# EAGLE board RK3188-EVB_Rev_C1 (EAGLE 4.16), part 1 of 3
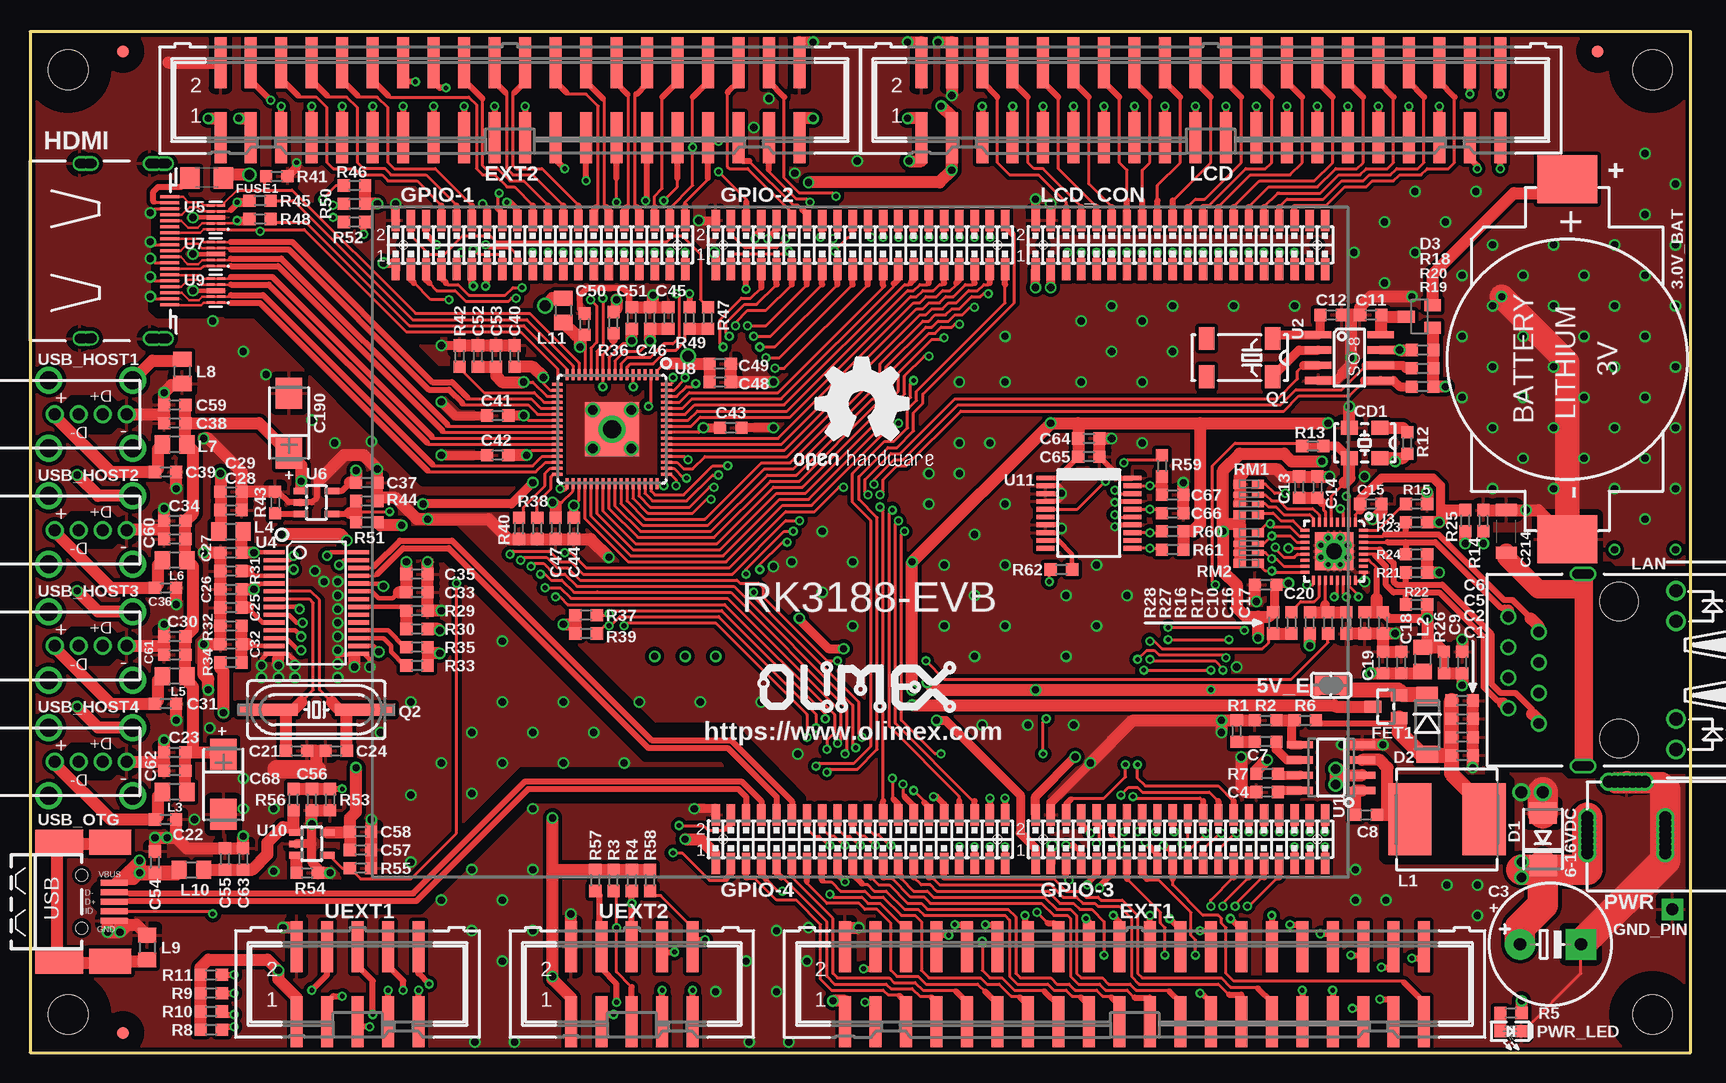
[diagram p5: board, top side]
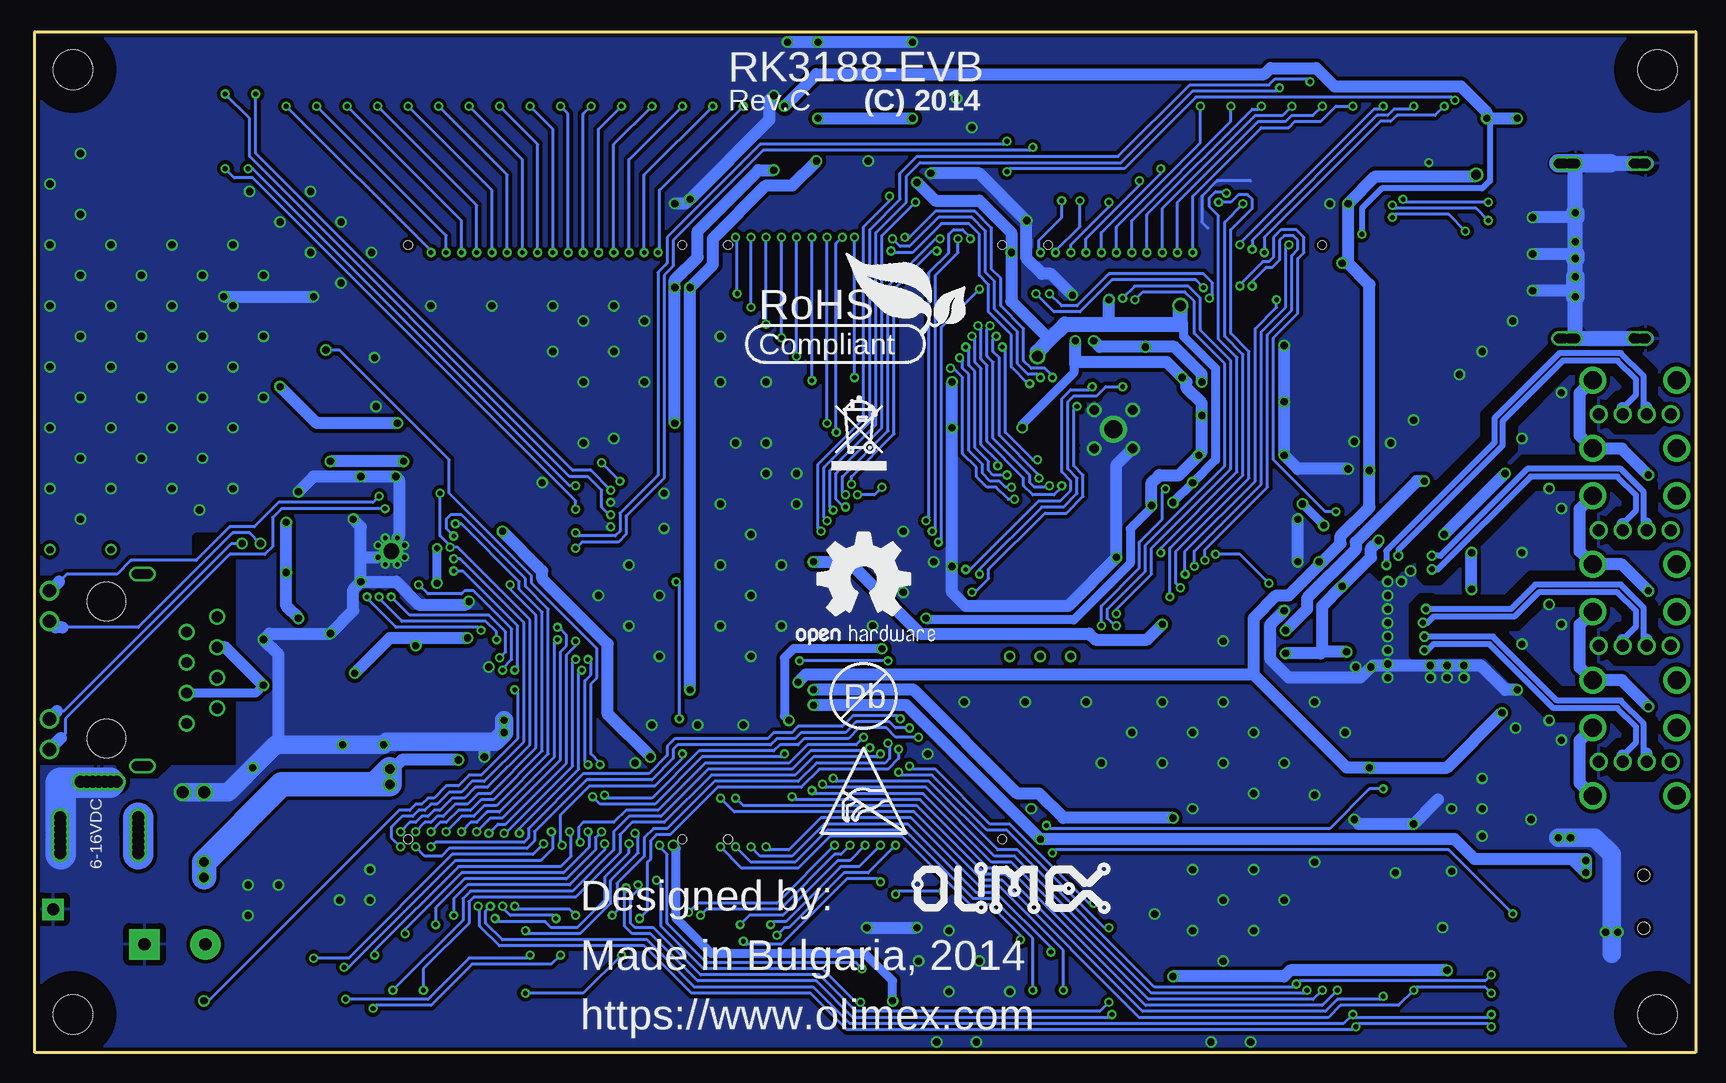
[diagram p6: board, bottom side, seen from below]

Size 138.43 x 85.09 mm. Coordinates in mm from the lower left corner, seen from the top.
Outline: 0,85.09 0,0 138.43,0 138.43,85.09 0,85.09
Copper layers (1+16): Top 0.035mm / dielectric 1.5mm / Bottom 0.035mm
Design rules "default": minimum track width 5mil, minimum drill 10mil, track to track 8mil, track to pad 8mil, pad to pad 8mil, via to via 8mil, smd to smd 1mil, copper to edge 10mil, drill to drill 8mil, minimum pad ring 7mil, minimum via ring 7mil, stop-mask expansion 4mil, vias tented up to drill 40mil, thermal gap 20mil
Net classes: 2 lan_sh: drill 0.762 mm
Holes 3.3 mm at 135.25,3.17 3.17,81.92 3.17,3.17 135.25,81.92
tRestrict: area 0,0 to 6.3,6.3; area 0,78.7 to 6.3,85.1; area 132.1,78.7 to 138.4,85.1; area 132.1,0 to 138.4,6.3; 75 lines
bRestrict: area 0,78.7 to 6.3,85.1; area 132.1,78.7 to 138.4,85.1; area 132.1,0 to 138.4,6.3; area 0,0 to 6.3,6.3; 99 lines

## Footprints (pad centres in the part's own frame; a part is rotated, then mirrored left to right if it is on the bottom)
3V_BAT_HOLDER = smd 2 x 2: 1+ -15,0 | smd 4 x 5: + -15,0; - 15,0
SJ-CLOSE = smd 1.168 x 1.6: 1 -0.762,0; 2 0.762,0
C0603_DWS = smd 1.016 x 1.016: 1 -0.889,0; 2 0.889,0
E5-10,5 = drill 1.016 pad 2.54 round: + -2.54,0 | drill 1.016 pad 2.54 square: - 2.54,0
CT6032 = smd 2.6 x 2.2: + 2.5,0; - -2.5,0
C1206_5MILS_WS_ISO = smd 1.016 x 1.778: 1 -1.778,0; 2 1.778,0
5032-4P_HCX-3S = smd 1.4 x 1.2: 1 -1.27,-1.27; 2 1.27,-1.27; 3 1.27,1.27; 4 -1.27,1.27
DO214AA = smd 1.778 x 2.286: A 2.177,0; C -2.177,0
MLL-41 = smd 1.45 x 1.8: A 2.445,0; K -2.445,0
SOT23C = smd 1.4 x 1: 1 1.1,-0.95; 2 1.1,0.95; 3 -1.1,0
ML40-MALE(GBH-254-SMT-40) = smd 1 x 4.25: 1 -24.13,-3.125; 2 -24.13,3.125; 3 -21.59,-3.125; 4 -21.59,3.125; 5 -19.05,-3.125; 6 -19.05,3.125; 7 -16.51,-3.125; 8 -16.51,3.125; 9 -13.97,-3.125; 10 -13.97,3.125; 11 -11.43,-3.125; 12 -11.43,3.125; 13 -8.89,-3.125; 14 -8.89,3.125; 15 -6.35,-3.125; 16 -6.35,3.125; 17 -3.81,-3.125; 18 -3.81,3.125; 19 -1.27,-3.125; 20 -1.27,3.125; 21 1.27,-3.125; 22 1.27,3.125; 23 3.81,-3.125; 24 3.81,3.125; 25 6.35,-3.125; 26 6.35,3.125; 27 8.89,-3.125; 28 8.89,3.125; 29 11.43,-3.125; 30 11.43,3.125; 31 13.97,-3.125; 32 13.97,3.125; 33 16.51,-3.125; 34 16.51,3.125; 35 19.05,-3.125; 36 19.05,3.125; 37 21.59,-3.125; 38 21.59,3.125; 39 24.13,-3.125; 40 24.13,3.125
SOT23 = smd 1.4 x 1: 1 1.1,-0.95; 2 1.1,0.95; 3 -1.1,0
FIDUCIAL-1X3 = smd 1 x 1: 1 0,0
1206 = smd 1.6 x 1.8: 1 -1.4,0; 2 1.4,0
TEST_PAD40/70/SQUARE = drill 1.016 pad 1.778 square: P$1 0,0
HDMI-SWM-19 = smd 0.25 x 1.6: 1 -4.5,-5.55; 2 -4,-5.55; 3 -3.5,-5.55; 4 -3,-5.55; 5 -2.5,-5.55; 6 -2,-5.55; 7 -1.5,-5.55; 8 -1,-5.55; 9 -0.5,-5.55; 10 0,-5.55; 11 0.5,-5.55; 12 1,-5.55; 13 1.5,-5.55; 14 2,-5.55; 15 2.5,-5.55; 16 3,-5.55; 17 3.5,-5.55; 18 4,-5.55; 19 4.5,-5.55 | drill 0.8 round: P$5 -7.3,-4.85; P$7 -7.3,1.25; P$9 7.3,1.25; P$11 7.3,-4.85; P$13 -7.3,-4.45; P$15 -7.3,1.65; P$18 7.3,1.65; P$20 7.3,-4.45; P$21 -7.3,-4.15; P$22 -7.3,-5; P$23 7.3,-5; P$24 7.3,-4.15; P$25 -7.3,-5.3; P$26 7.3,-5.3; P$27 7.3,0.95; P$28 -7.275,0.95; SH1 -7.3,-3.9; SH2 -7.3,1.95; SH3 7.3,1.95; SH4 7.3,-3.9
8X8MM_3131 = smd 3.6 x 6: 1 -3.1,0; 2 3.1,0
L0805_5MIL_DWS = smd 1.27 x 1.524: 1 -1.016,0; 2 1.016,0
RJLBC-060TC1_MILLING = drill 0.9 round: 1 -4.455,6.7; 2 -3.185,9.24; 3 -1.915,6.7; 4 -0.645,9.24; 5 0.625,6.7; 6 1.895,9.24; 7 3.165,6.7; 8 4.435,9.24 | drill 0.8 round: _1 -8,2.5; _2 -8,2.7; _3 -8,2.9; _4 -8,3.3; _5 -8,3.5; _6 8,3.5; _7 8,3.3; _8 8,2.9; _9 8,2.7; _10 8,2.5; GND1 -8,3.1; GND2 8,3.1 | drill 1.1 round: AG 4.07,-4.748; AY -6.61,-4.748; KG 6.61,-4.748; KY -4.07,-4.748 | hole 3.2: -5.715,0; 5.715,0
PWR_JACK_UNI_MILLING = drill 1 round: + 0,4.75; +1 0,5.25; +2 0,5.75; +3 0,6.25; +4 0,4.25; +5 0,3.75; +6 0,3.25; - -6.5,4.75; -1 -6.5,5.25; -2 -6.5,5.75; -3 -6.5,4.25; -4 -6.5,3.75; -5 -6.5,6.25; -6 -6.5,3.25; -- -3.3,0.3; --1 -3.8,0.3; --2 -4.3,0.3; --3 -4.8,0.3; --4 -2.8,0.3; --5 -2.3,0.3; --6 -1.8,0.3
LED-0603 = smd 1.016 x 1.016: A 0.889,0; C -0.889,0
MC-306 = smd 1.3 x 1.9: 1 -2.75,-1.6; 2 2.75,-1.6; 3 2.75,1.6; 4 -2.75,1.6
HC49/SMD2_THIN = smd 5 x 1: 1 -4.064,0; 2 4.064,0
R0603_5MIL_DWS = smd 1.016 x 1.016: 1 -0.889,0; 2 0.889,0
0603_0R = smd 1.016 x 1.016: 1 -0.889,0; 2 0.889,0
RK3188-SOM-EVB_REV_B = smd 0.7 x 1.8: 1-1 -38.735,22.733; 1-2 -38.735,26.797; 1-3 -37.465,22.733; 1-4 -37.465,26.797; 1-5 -36.195,22.733; 1-6 -36.195,26.797; 1-7 -34.925,22.733; 1-8 -34.925,26.797; 1-9 -33.655,22.733; 1-10 -33.655,26.797; 1-11 -32.385,22.733; 1-12 -32.385,26.797; 1-13 -31.115,22.733; 1-14 -31.115,26.797; 1-15 -29.845,22.733; 1-16 -29.845,26.797; 1-17 -28.575,22.733; 1-18 -28.575,26.797; 1-19 -27.305,22.733; 1-20 -27.305,26.797; 1-21 -26.035,22.733; 1-22 -26.035,26.797; 1-23 -24.765,22.733; 1-24 -24.765,26.797; 1-25 -23.495,22.733; 1-26 -23.495,26.797; 1-27 -22.225,22.733; 1-28 -22.225,26.797; 1-29 -20.955,22.733; 1-30 -20.955,26.797; 1-31 -19.685,22.733; 1-32 -19.685,26.797; 1-33 -18.415,22.733; 1-34 -18.415,26.797; 1-35 -17.145,22.733; 1-36 -17.145,26.797; 1-37 -15.875,22.733; 1-38 -15.875,26.797; 1-39 -14.605,22.733; 1-40 -14.605,26.797; 2-1 -12.065,22.733; 2-2 -12.065,26.797; 2-3 -10.795,22.733; 2-4 -10.795,26.797; 2-5 -9.525,22.733; 2-6 -9.525,26.797; 2-7 -8.255,22.733; 2-8 -8.255,26.797; 2-9 -6.985,22.733; 2-10 -6.985,26.797; 2-11 -5.715,22.733; 2-12 -5.715,26.797; 2-13 -4.445,22.733; 2-14 -4.445,26.797; 2-15 -3.175,22.733; 2-16 -3.175,26.797; 2-17 -1.905,22.733; 2-18 -1.905,26.797; 2-19 -0.635,22.733; 2-20 -0.635,26.797; 2-21 0.635,22.733; 2-22 0.635,26.797; 2-23 1.905,22.733; 2-24 1.905,26.797; 2-25 3.175,22.733; 2-26 3.175,26.797; 2-27 4.445,22.733; 2-28 4.445,26.797; 2-29 5.715,22.733; 2-30 5.715,26.797; 2-31 6.985,22.733; 2-32 6.985,26.797; 2-33 8.255,22.733; 2-34 8.255,26.797; 2-35 9.525,22.733; 2-36 9.525,26.797; 2-37 10.795,22.733; 2-38 10.795,26.797; 2-39 12.065,22.733; 2-40 12.065,26.797; 3-1 14.605,-26.797; 3-2 14.605,-22.733; 3-3 15.875,-26.797; 3-4 15.875,-22.733; 3-5 17.145,-26.797; 3-6 17.145,-22.733; 3-7 18.415,-26.797; 3-8 18.415,-22.733; 3-9 19.685,-26.797; 3-10 19.685,-22.733; 3-11 20.955,-26.797; 3-12 20.955,-22.733; 3-13 22.225,-26.797; 3-14 22.225,-22.733; 3-15 23.495,-26.797; 3-16 23.495,-22.733; 3-17 24.765,-26.797; 3-18 24.765,-22.733; 3-19 26.035,-26.797; 3-20 26.035,-22.733; 3-21 27.305,-26.797; 3-22 27.305,-22.733; 3-23 28.575,-26.797; 3-24 28.575,-22.733; 3-25 29.845,-26.797; 3-26 29.845,-22.733; 3-27 31.115,-26.797; 3-28 31.115,-22.733; 3-29 32.385,-26.797; 3-30 32.385,-22.733; 3-31 33.655,-26.797; 3-32 33.655,-22.733; 3-33 34.925,-26.797; 3-34 34.925,-22.733; 3-35 36.195,-26.797; 3-36 36.195,-22.733; 3-37 37.465,-26.797; 3-38 37.465,-22.733; 3-39 38.735,-26.797; 3-40 38.735,-22.733; 4-1 -12.065,-26.797; 4-2 -12.065,-22.733; 4-3 -10.795,-26.797; 4-4 -10.795,-22.733; 4-5 -9.525,-26.797; 4-6 -9.525,-22.733; 4-7 -8.255,-26.797; 4-8 -8.255,-22.733; 4-9 -6.985,-26.797; 4-10 -6.985,-22.733; 4-11 -5.715,-26.797; 4-12 -5.715,-22.733; 4-13 -4.445,-26.797; 4-14 -4.445,-22.733; 4-15 -3.175,-26.797; 4-16 -3.175,-22.733; 4-17 -1.905,-26.797; 4-18 -1.905,-22.733; 4-19 -0.635,-26.797; 4-20 -0.635,-22.733; 4-21 0.635,-26.797; 4-22 0.635,-22.733; 4-23 1.905,-26.797; 4-24 1.905,-22.733; 4-25 3.175,-26.797; 4-26 3.175,-22.733; 4-27 4.445,-26.797; 4-28 4.445,-22.733; 4-29 5.715,-26.797; 4-30 5.715,-22.733; 4-31 6.985,-26.797; 4-32 6.985,-22.733; 4-33 8.255,-26.797; 4-34 8.255,-22.733; 4-35 9.525,-26.797; 4-36 9.525,-22.733; 4-37 10.795,-26.797; 4-38 10.795,-22.733; 4-39 12.065,-26.797; 4-40 12.065,-22.733; LCD-1 14.605,22.733; LCD-2 14.605,26.797; LCD-3 15.875,22.733; LCD-4 15.875,26.797; LCD-5 17.145,22.733; LCD-6 17.145,26.797; LCD-7 18.415,22.733; LCD-8 18.415,26.797; LCD-9 19.685,22.733; LCD-10 19.685,26.797; LCD-11 20.955,22.733; LCD-12 20.955,26.797; LCD-13 22.225,22.733; LCD-14 22.225,26.797; LCD-15 23.495,22.733; LCD-16 23.495,26.797; LCD-17 24.765,22.733; LCD-18 24.765,26.797; LCD-19 26.035,22.733; LCD-20 26.035,26.797; LCD-21 27.305,22.733; LCD-22 27.305,26.797; LCD-23 28.575,22.733; LCD-24 28.575,26.797; LCD-25 29.845,22.733; LCD-26 29.845,26.797; LCD-27 31.115,22.733; LCD-28 31.115,26.797; LCD-29 32.385,22.733; LCD-30 32.385,26.797; LCD-31 33.655,22.733; LCD-32 33.655,26.797; LCD-33 34.925,22.733; LCD-34 34.925,26.797; LCD-35 36.195,22.733; LCD-36 36.195,26.797; LCD-37 37.465,22.733; LCD-38 37.465,26.797; LCD-39 38.735,22.733; LCD-40 38.735,26.797 | hole 0.7: -38.1,24.765; -15.24,24.765; -11.43,-24.765; 11.43,-24.765; 15.24,-24.765; 38.1,-24.765; -11.43,24.765; 11.43,24.765; 15.24,24.765; 38.1,24.765
R_MATRIX_4 = smd 0.762 x 1.016: 1.1 -1.27,-0.762; 1.2 -1.27,0.762; 4.1 1.27,-0.762; 4.2 1.27,0.762 | smd 0.508 x 1.016: 2.1 -0.381,-0.762; 2.2 -0.381,0.762; 3.1 0.381,-0.762; 3.2 0.381,0.762
SOIC8 = smd 0.6 x 2.2: 1 -1.905,-2.6; 2 -0.635,-2.6; 3 0.635,-2.6; 4 1.905,-2.6; 5 1.905,2.6; 6 0.635,2.6; 7 -0.635,2.6; 8 -1.905,2.6
SO-8 = smd 0.6 x 2.2: 1 -1.905,-2.6; 2 -0.635,-2.6; 3 0.635,-2.6; 4 1.905,-2.6; 5 1.905,2.6; 6 0.635,2.6; 7 -0.635,2.6; 8 -1.905,2.6
QFN-32(DRILLS) = smd 0.25 x 0.75: 1 -1.75,-2.425; 2 -1.25,-2.425; 3 -0.75,-2.425; 4 -0.25,-2.425; 5 0.25,-2.425; 6 0.75,-2.425; 7 1.25,-2.425; 8 1.75,-2.425; 17 1.75,2.425; 18 1.25,2.425; 19 0.75,2.425; 20 0.25,2.425; 21 -0.25,2.425; 22 -0.75,2.425; 23 -1.25,2.425; 24 -1.75,2.425 | smd 0.75 x 0.25: 9 2.425,-1.75; 10 2.425,-1.25; 11 2.425,-0.75; 12 2.425,-0.25; 13 2.425,0.25; 14 2.425,0.75; 15 2.425,1.25; 16 2.425,1.75; 25 -2.425,1.75; 26 -2.425,1.25; 27 -2.425,0.75; 28 -2.425,0.25; 29 -2.425,-0.25; 30 -2.425,-0.75; 31 -2.425,-1.25; 32 -2.425,-1.75 | drill 1.3 round: EP1 0,0 | drill 0.4 round: EP2 -0.5,1.1; EP3 0.5,1.1; EP4 1.1,0.5; EP5 1.1,-0.5; EP6 0.5,-1.1; EP7 -0.5,-1.1; EP8 -1.1,-0.5; EP9 -1.1,0.5 | smd 3.2 x 3.2: EXP_PAD 0,0
SSOP28 = smd 0.35 x 1.75: 1 -4.225,-3.525; 2 -3.575,-3.525; 3 -2.925,-3.525; 4 -2.275,-3.525; 5 -1.625,-3.525; 6 -0.975,-3.525; 7 -0.325,-3.525; 8 0.325,-3.525; 9 0.975,-3.525; 10 1.625,-3.525; 11 2.275,-3.525; 12 2.925,-3.525; 13 3.575,-3.525; 14 4.225,-3.525; 15 4.225,3.525; 16 3.575,3.525; 17 2.925,3.525; 18 2.275,3.525; 19 1.625,3.525; 20 0.975,3.525; 21 0.325,3.525; 22 -0.325,3.525; 23 -0.975,3.525; 24 -1.625,3.525; 25 -2.275,3.525; 26 -2.925,3.525; 27 -3.575,3.525; 28 -4.225,3.525
SLP2510P8 = smd 0.2 x 0.675: 1 -1,-0.438; 2 -0.5,-0.438; 4 0.5,-0.438; 5 1,-0.438; 6 1,0.438; 7 0.5,0.438; 9 -0.5,0.438; 10 -1,0.438 | smd 0.4 x 0.775: 3 0,-0.388; 8 0,0.388
SOT23-5 = smd 1.2 x 0.55: 1 1.3,-0.95; 2 1.3,0; 3 1.3,0.95; 4 -1.3,0.95; 5 -1.3,-0.95
QFN64(IT66121FN) = smd 0.9 x 0.25: 1 -4.55,3.75; 2 -4.55,3.25; 3 -4.55,2.75; 4 -4.55,2.25; 5 -4.55,1.75; 6 -4.55,1.25; 7 -4.55,0.75; 8 -4.55,0.25; 9 -4.55,-0.25; 10 -4.55,-0.75; 11 -4.55,-1.25; 12 -4.55,-1.75; 13 -4.55,-2.25; 14 -4.55,-2.75; 15 -4.55,-3.25; 16 -4.55,-3.75; 33 4.55,-3.75; 34 4.55,-3.25; 35 4.55,-2.75; 36 4.55,-2.25; 37 4.55,-1.75; 38 4.55,-1.25; 39 4.55,-0.75; 40 4.55,-0.25; 41 4.55,0.25; 42 4.55,0.75; 43 4.55,1.25; 44 4.55,1.75; 45 4.55,2.25; 46 4.55,2.75; 47 4.55,3.25; 48 4.55,3.75 | smd 0.25 x 0.9: 17 -3.75,-4.55; 18 -3.25,-4.55; 19 -2.75,-4.55; 20 -2.25,-4.55; 21 -1.75,-4.55; 22 -1.25,-4.55; 23 -0.75,-4.55; 24 -0.25,-4.55; 25 0.25,-4.55; 26 0.75,-4.55; 27 1.25,-4.55; 28 1.75,-4.55; 29 2.25,-4.55; 30 2.75,-4.55; 31 3.25,-4.55; 32 3.75,-4.55; 49 3.75,4.55; 50 3.25,4.55; 51 2.75,4.55; 52 2.25,4.55; 53 1.75,4.55; 54 1.25,4.55; 55 0.75,4.55; 56 0.25,4.55; 57 -0.25,4.55; 58 -0.75,4.55; 59 -1.25,4.55; 60 -1.75,4.55; 61 -2.25,4.55; 62 -2.75,4.55; 63 -3.25,4.55; 64 -3.75,4.55 | smd 4.5 x 4.5: GND 0,0 | drill 1.5 round: GND1 0,0 | drill 0.8 round: GND2 -1.6,1.6; GND3 1.6,1.6; GND4 1.6,-1.6; GND5 -1.6,-1.6
SSOP20 = smd 0.4 x 1.5: 1 -2.925,-3.625; 2 -2.275,-3.625; 3 -1.625,-3.625; 4 -0.975,-3.625; 5 -0.325,-3.625; 6 0.325,-3.625; 7 0.975,-3.625; 8 1.625,-3.625; 9 2.275,-3.625; 10 2.925,-3.625; 11 2.925,3.625; 12 2.275,3.625; 13 1.625,3.625; 14 0.975,3.625; 15 0.325,3.625; 16 -0.325,3.625; 17 -0.975,3.625; 18 -1.625,3.625; 19 -2.275,3.625; 20 -2.925,3.625
ML10_S = smd 1 x 4.25: 1 -5.08,-3.125; 2 -5.08,3.125; 3 -2.54,-3.125; 4 -2.54,3.125; 5 0,-3.125; 6 0,3.125; 7 2.54,-3.125; 8 2.54,3.125; 9 5.08,-3.125; 10 5.08,3.125
USB_A_VERTICAL_PTH = drill 1 round: 1 3.45,12.75; 2 3.45,14.75; 3 3.45,16.75; 4 3.45,18.75 | drill 1.5 round: P$1 0.6,12.25; P$2 6.3,12.25; P$3 6.3,19.25; P$4 0.6,19.25
USB_MINI_9PIN = smd 2.25 x 0.5: D+ 2.706,0; D- 2.706,0.8; GND 2.706,-1.6; ID 2.706,-0.8; VBUS 2.706,1.6 | smd 4 x 2.1: GND1 -1.9,4.95; GND3 -1.9,-4.95 | smd 3.5 x 2.1: GND2 2.35,4.95; GND4 2.35,-4.95 | hole 1: 0,2.2; 0,-2.2

## Placement (x,y rotation side)
3.0V_BAT  BTH-V-20-LF  [3V_BAT_HOLDER]  128.14,57.78 270 top
5V_E  Close  [SJ-CLOSE]  108.46,30.61 180 top
C1  22uF/6.3V  [C0603_DWS]  119.38,24.77 0 top
C2  22uF/6.3V  [C0603_DWS]  119.38,26.29 0 top
C3  470uF/25V/LOWESR/105C  [E5-10,5]  126.75,9.02 0 top
C4  100nF  [C0603_DWS]  103.12,21.72 180 top
C5  22uF/6.3V  [C0603_DWS]  119.38,27.81 0 top
C6  22uF/6.3V  [C0603_DWS]  119.38,29.34 0 top
C7  3.3nF  [C0603_DWS]  103,25.91 180 top
C8  10nF  [C0603_DWS]  111.38,19.81 0 top
C9  100nF  [C0603_DWS]  119.38,32.51 270 top
C10  10uF/6.3V  [C0603_DWS]  109.73,35.81 90 top
C11  100nF  [C0603_DWS]  111.76,61.47 0 top
C12  10pF  [C0603_DWS]  108.46,61.47 0 top
C13  100nF  [C0603_DWS]  105.79,47.12 270 top
C14  2.2uF/6.3V  [C0603_DWS]  107.31,47.12 270 top
C15  100nF  [C0603_DWS]  111.76,45.72 180 top
C16  100nF  [C0603_DWS]  111.25,35.81 90 top
C17  22uF/6.3V  [C0603_DWS]  112.78,35.81 90 top
C18  22uF/6.3V  [C0603_DWS]  114.3,32.51 270 top
C19  22uF/6.3V  [C0603_DWS]  112.78,32.51 270 top
C20  100nF  [C0603_DWS]  103,38.99 0 top
C21  33pF  [C0603_DWS]  22.23,25.15 180 top
C22  100nF  [C0603_DWS]  11.3,19.43 0 top
C23  22uF/6.3V  [C0603_DWS]  12.06,25.02 0 top
C24  33pF  [C0603_DWS]  25.53,25.15 0 top
C25  100nF  [C0603_DWS]  16.76,37.08 180 top
C26  100nF  [C0603_DWS]  16.76,38.61 180 top
C27  100nF  [C0603_DWS]  16.76,41.66 180 top
C28  10uF/6.3V  [C0603_DWS]  16.76,45.21 0 top
C29  100nF  [C0603_DWS]  16.76,46.74 0 top
C30  22uF/6.3V  [C0603_DWS]  12.06,34.67 0 top
C31  100nF  [C0603_DWS]  11.3,29.08 0 top
C32  2.2uF/6.3V  [C0603_DWS]  16.76,34.04 0 top
C33  100nF  [C0603_DWS]  32.26,38.35 0 top
C34  22uF/6.3V  [C0603_DWS]  12.06,44.32 0 top
C35  10uF/6.3V  [C0603_DWS]  32.26,39.88 0 top
C36  100nF  [C0603_DWS]  11.3,38.73 0 top
C37  22uF/6.3V  [C0603_DWS]  28.07,47.5 0 top
C38  22uF/6.3V  [C0603_DWS]  12.06,52.45 0 top
C39  100nF  [C0603_DWS]  11.3,48.39 0 top
C40  100nF  [C0603_DWS]  40.39,58.04 90 top
C41  100nF  [C0603_DWS]  38.99,53.09 180 top
C42  100nF  [C0603_DWS]  38.99,49.78 180 top
C43  100nF  [C0603_DWS]  58.42,52.07 0 top
C44  100nF  [C0603_DWS]  45.34,43.69 270 top
C45  100nF  [C0603_DWS]  53.21,61.21 90 top
C46  22uF/6.3V  [C0603_DWS]  51.69,61.21 90 top
C47  100nF  [C0603_DWS]  43.81,43.69 270 top
C48  100nF  [C0603_DWS]  57.53,55.88 0 top
C49  22uF/6.3V  [C0603_DWS]  57.53,57.4 0 top
C50  100nF  [C0603_DWS]  46.23,60.71 90 top
C51  100nF  [C0603_DWS]  50.16,61.21 90 top
C52  100nF  [C0603_DWS]  37.34,58.04 90 top
C53  22uF/6.3V  [C0603_DWS]  38.86,58.04 90 top
C54  100nF  [C0603_DWS]  10.41,15.88 90 top
C55  22uF/6.3V  [C0603_DWS]  16.26,16.13 90 top
C56  100nF  [C0603_DWS]  23.5,21.08 270 top
C57  100nF  [C0603_DWS]  27.56,16.89 0 top
C58  22uF/6.3V  [C0603_DWS]  27.56,18.41 0 top
C59  22uF/6.3V  [C0603_DWS]  12.06,53.98 0 top
C60  22uF/6.3V  [C0603_DWS]  12.06,42.8 0 top
C61  22uF/6.3V  [C0603_DWS]  12.06,33.15 0 top
C62  22uF/6.3V  [C0603_DWS]  12.06,23.5 0 top
C63  22uF/6.3V  [C0603_DWS]  17.78,16.13 90 top
C64  10uF/6.3V  [C0603_DWS]  88.27,51.18 0 top
C65  100nF  [C0603_DWS]  88.27,49.66 0 top
C66  10nF  [C0603_DWS]  95.25,44.96 180 top
C67  10nF  [C0603_DWS]  95.25,46.48 180 top
C68  NA(220uF/6.3V/tant)  [CT6032]  16.13,22.35 90 top
C190  NA(220uF/6.3V/tant)  [CT6032]  21.59,52.45 270 top
C214  1nF/2kV/X7R/1206  [C1206_5MILS_WS_ISO]  123.06,43.43 90 top
CD1  NA(50Mhz_osc_5032_4p)  [5032-4P_HCX-3S]  111.25,50.8 180 top
D1  SMBJ16A  [DO214AA]  126.11,17.78 90 top
D2  1N5822/SS34/SMA  [MLL-41]  116.46,27.3 270 top
D3  BAT54C  [SOT23C]  115.82,61.34 0 top
EXT1  GBH-254-SMT-40  [ML40-MALE(GBH-254-SMT-40)]  92.08,5.71 0 top
EXT2  GBH-254-SMT-40  [ML40-MALE(GBH-254-SMT-40)]  40.01,79.38 0 top
FET1  IRLML6402  [SOT23]  113.03,28.83 0 top
FID1  FIDUCIAL  [FIDUCIAL-1X3]  7.75,83.44 0 top
FID3  FIDUCIAL  [FIDUCIAL-1X3]  7.75,1.65 180 top
FID4  FIDUCIAL  [FIDUCIAL-1X3]  130.68,83.44 180 top
FUSE1  FSMD035  [1206]  14.73,72.9 180 top
GND_PIN  TESTPAD3  [TEST_PAD40/70/SQUARE]  136.91,11.94 180 top
HDMI  HDMI-MC34931HDMI-SWM-19  [HDMI-SWM-19]  6.1,66.8 90 top
L1  10uH/3.15A/20%  [8X8MM_3131]  118.11,19.43 0 top
L2  FB0805/600R/200mA(201209-601)  [L0805_5MIL_DWS]  116.08,32.77 270 top
L3  FB0805/600R/2A  [L0805_5MIL_DWS]  12.06,21.72 180 top
L4  FB0805/600R/2A  [L0805_5MIL_DWS]  16.76,43.43 0 top
L5  FB0805/600R/2A  [L0805_5MIL_DWS]  12.06,31.37 180 top
L6  FB0805/600R/2A  [L0805_5MIL_DWS]  12.06,41.02 180 top
L7  FB0805/600R/2A  [L0805_5MIL_DWS]  12.06,50.67 180 top
L8  FB0805/600R/2A  [L0805_5MIL_DWS]  12.7,56.77 90 top
L9  FB0805/600R/200mA(201209-601)  [L0805_5MIL_DWS]  9.78,8.76 270 top
L10  FB0805/600R/2A  [L0805_5MIL_DWS]  13.46,15.24 0 top
L11  CL470nH/0805/1.76R/250mA  [L0805_5MIL_DWS]  44.45,61.85 270 top
LAN  RJLBC-060TC1  [RJLBC-060TC1_MILLING]  132.46,31.88 90 top
LCD  GBH-254-SMT-40  [ML40-MALE(GBH-254-SMT-40)]  98.42,79.38 0 top
PWR  YDJ-1136  [PWR_JACK_UNI_MILLING]  129.79,22.86 180 top
PWR_LED  LED/RED/0603  [LED-0603]  123.44,1.78 180 top
Q1  MC-306_32.768KHZ/6pF  [MC-306]  100.84,57.91 180 top
Q2  Q12.000MHz/HC-49SM/SMD/20ppm/20pF  [HC49/SMD2_THIN]  23.88,28.57 0 top
R1  2.2k  [R0603_5MIL_DWS]  100.58,26.8 90 top
R2  1.05k/1%  [R0603_5MIL_DWS]  103,27.69 180 top
R3  NA(2.2k)  [R0603_5MIL_DWS]  48.64,14.35 90 top
R4  NA(2.2k)  [R0603_5MIL_DWS]  50.16,14.35 90 top
R5  2.2k  [R0603_5MIL_DWS]  123.44,3.3 180 top
R6  4.99k/1%  [R0603_5MIL_DWS]  106.3,27.69 0 top
R7  10k  [R0603_5MIL_DWS]  103.12,23.24 0 top
R8  NA(2.2k)  [R0603_5MIL_DWS]  15.11,1.91 180 top
R9  100k  [R0603_5MIL_DWS]  15.11,4.95 180 top
R10  NA(2.2k)  [R0603_5MIL_DWS]  15.11,3.43 180 top
R11  100k  [R0603_5MIL_DWS]  15.11,6.48 180 top
R12  NA(47k)  [R0603_5MIL_DWS]  114.81,50.8 90 top
R13  0R(board_mounted)  [0603_0R]  106.93,50.55 0 top
R14  560R  [R0603_5MIL_DWS]  121.16,44.32 90 top
R15  12.1k/1%  [R0603_5MIL_DWS]  115.57,45.72 180 top
R16  10k  [R0603_5MIL_DWS]  106.68,35.81 90 top
R17  NA  [R0603_5MIL_DWS]  108.2,35.81 90 top
R18  10k  [R0603_5MIL_DWS]  116.08,58.55 0 top
R19  NA  [R0603_5MIL_DWS]  116.08,55.5 0 top
R20  NA  [R0603_5MIL_DWS]  116.08,57.02 0 top
R21  49.9R/1%  [R0603_5MIL_DWS]  115.57,40.01 0 top
R22  49.9R/1%  [R0603_5MIL_DWS]  115.57,37.34 0 top
R23  49.9R/1%  [R0603_5MIL_DWS]  115.57,44.2 0 top
R24  49.9R/1%  [R0603_5MIL_DWS]  115.57,41.53 0 top
R25  560R  [R0603_5MIL_DWS]  119.63,44.32 270 top
R26  0R(board_mounted)  [0603_0R]  117.86,32.51 90 top
R27  150R  [R0603_5MIL_DWS]  105.16,35.81 90 top
R28  10k  [R0603_5MIL_DWS]  103.63,35.81 90 top
R29  NA(10k)  [R0603_5MIL_DWS]  32.26,36.83 180 top
R30  NA(5.1k)  [R0603_5MIL_DWS]  32.26,35.31 0 top
R31  680R/1%  [R0603_5MIL_DWS]  16.76,40.13 0 top
R32  NA(47k)  [R0603_5MIL_DWS]  16.76,35.56 180 top
R33  10k  [R0603_5MIL_DWS]  32.26,32.26 180 top
R34  4.99k/1%  [R0603_5MIL_DWS]  16.76,32.51 180 top
R35  47k  [R0603_5MIL_DWS]  32.26,33.78 180 top
R36  10k  [R0603_5MIL_DWS]  48.64,60.83 90 top
R37  2.2k  [R0603_5MIL_DWS]  46.35,36.45 180 top
R38  10k  [R0603_5MIL_DWS]  42.29,43.69 270 top
R39  2.2k  [R0603_5MIL_DWS]  46.35,34.92 180 top
R40  10k  [R0603_5MIL_DWS]  40.77,43.69 270 top
R41  47k  [R0603_5MIL_DWS]  20.57,73.03 0 top
R42  10k  [R0603_5MIL_DWS]  35.81,58.04 90 top
R43  6.8k/1%  [R0603_5MIL_DWS]  20.45,45.85 270 top
R44  10k  [R0603_5MIL_DWS]  28.07,45.97 180 top
R45  22R  [R0603_5MIL_DWS]  19.18,70.99 0 top
R46  2.2k  [R0603_5MIL_DWS]  27.05,72.26 0 top
R47  22R  [R0603_5MIL_DWS]  56.52,61.21 270 top
R48  22R  [R0603_5MIL_DWS]  19.18,69.47 0 top
R49  22R  [R0603_5MIL_DWS]  54.99,61.21 270 top
R50  2.2k  [R0603_5MIL_DWS]  27.05,70.74 0 top
R51  NA  [R0603_5MIL_DWS]  28.07,44.2 180 top
R52  10k  [R0603_5MIL_DWS]  27.05,69.22 0 top
R53  100k  [R0603_5MIL_DWS]  25.02,21.08 90 top
R54  13k/1%  [R0603_5MIL_DWS]  23.11,14.99 180 top
R55  100k  [R0603_5MIL_DWS]  27.56,15.37 180 top
R56  47k  [R0603_5MIL_DWS]  21.97,21.08 270 top
R57  100k  [R0603_5MIL_DWS]  47.12,14.35 90 top
R58  100k  [R0603_5MIL_DWS]  51.69,14.35 90 top
R59  20k  [R0603_5MIL_DWS]  94.36,48.9 270 top
R60  2.2k  [R0603_5MIL_DWS]  95.25,43.43 0 top
R61  2.2k  [R0603_5MIL_DWS]  95.25,41.91 0 top
R62  560R  [R0603_5MIL_DWS]  85.98,40.26 180 top
RK3188-SOM-EVB_PLATFORM1  RK3188-SOM-EVB_REV_B-5XGPH127SMT-02X20(PA-V16X-2X20-LF)  [RK3188-SOM-EVB_REV_B]  69.22,42.55 0 top
RM1  RA1206_(4X0603)_4B8_4.7k  [R_MATRIX_4]  101.6,46.1 90 top
RM2  RA1206_(4X0603)_4B8_4.7k  [R_MATRIX_4]  101.6,42.04 270 top
U1  MP1482DS  [SOIC8]  108.46,23.75 90 top
U2  PCF8563T/5  [SO-8]  109.98,57.91 270 top
U3  LAN8710A-EZC  [QFN-32(DRILLS)]  108.71,41.78 180 top
U4  GL850G-HHGXX  [SSOP28]  23.88,37.47 270 top
U5  NA(RCLAMP0524P)  [SLP2510P8]  15.49,69.6 90 top
U6  SY6280  [SOT23-5]  23.88,45.85 180 top
U7  NA(RCLAMP0524P)  [SLP2510P8]  15.49,66.55 90 top
U8  IT66121FN  [QFN64(IT66121FN)]  48.51,51.94 270 top
U9  NA(RCLAMP0524P)  [SLP2510P8]  15.49,63.5 90 top
U10  SY6280  [SOT23-5]  23.5,17.4 180 top
U11  AR1021-I/SS  [SSOP20]  88.27,44.96 270 top
U$2  [LOGO-OPENHARDWARE_8X8]  69.34,39.37 0 bottom
U$3  [OLIMEX1_V]  47.62,11.43 0 bottom
U$4  [LOGO-OPENHARDWARE_8X8]  69.34,53.98 0 top
U$8  [OLIMEX1_V]  78.36,28.19 0 top
U$9  [PB]  69.34,29.72 0 bottom
U$10  [ESD_SYMBOL]  72.9,18.29 0 bottom
U$11  [RECYCLE_BIN1/8]  72.01,48.51 0 bottom
U$12  [ROHS]  78.11,58.17 0 bottom
UEXT1  GBH-254-SMT-10  [ML10_S]  27.3,5.71 0 top
UEXT2  GBH-254-SMT-10  [ML10_S]  50.16,5.71 0 top
USB_HOST1  USB_A_VERTICAL  [USB_A_VERTICAL_PTH]  -10.67,56.64 270 top
USB_HOST2  USB_A_VERTICAL  [USB_A_VERTICAL_PTH]  -10.67,46.99 270 top
USB_HOST3  USB_A_VERTICAL  [USB_A_VERTICAL_PTH]  -10.67,37.34 270 top
USB_HOST4  USB_A_VERTICAL  [USB_A_VERTICAL_PTH]  -10.67,27.69 270 top
USB_OTG  USB-OTG  [USB_MINI_9PIN]  4.32,12.57 0 top

## Tracks (layer width: path | path; a pad name or v marks a point on that pad's centre or on a via)
#OVCUR1
  Top 0.356: U4.21 31.06,37.14 R29.2
  Top 1.016: R29.2 R30.1
+5V  (via drill 0.4, 0.6, 0.8)
  Top 0.356: U4.23 28.49,38.44 29.08,37.85 30.23,37.85 30.73,38.35
  Top 0.508: U6.5 25.97,46.8 26.67,47.5
  Top 0.762: RK3188-SOM-EVB_PLATFORM1.1-1 30.48,65.79 v29.46,65.79 | v83.82,63.75 RK3188-SOM-EVB_PLATFORM1.LCD-1
  Top 1.016: v124.33,4.32 R5.1 | 26.67,47.5 C37.1 v27.18,48.51 | R34.2 15.88,32 16.13,31.75 v16.13,28.32 | 30.73,38.35 C33.1 C35.1 v31.37,40.89 | U10.5 26.67,18.35 C58.1 | C58.1 C57.1 | C58.1 26.67,19.56 27.18,20.07 v27.18,23.75 | R46.2 R50.2 v28.96,70.74 | FUSE1.1 16.39,73.15 v18.29,73.15 | 5V_E.2 107.31,30.23 v98.42,30.23 v83.82,30.23 75.44,30.23 v74.8,30.86 | EXT2.39 64.14,77.85 v65.28,77.85 | v73.15,77.85 74.3,77.85 LCD.1 74.3,74.3 v73.28,74.3
  Bottom 0.254: v124.33,4.32 123.95,4.32 108.08,20.19 107.19,20.19 106.68,20.7 106.17,20.7 105.66,21.21 105.16,21.21 104.14,22.23 103.12,22.23 102.23,23.11 101.22,23.11 98.17,26.16 98.17,29.97 v98.42,30.23
  Bottom 1.016: v16.13,28.32 20.7,23.75 v27.18,23.75 29.08,23.75 36.83,31.5 | v73.15,77.85 v65.28,77.85 | 28.96,65.79 v28.96,70.74 26.67,73.03 18.41,73.03 v18.29,73.15 | 36.83,31.5 36.83,36.2 34.92,38.1 33.91,38.1 31.37,40.64 v31.37,40.89 31.11,40.89 29.59,42.42 29.59,43.05 27.18,45.47 v27.18,48.51 27.18,64.01 28.96,65.79 | 28.96,65.79 v29.46,65.79 | v73.28,74.3 75.31,72.26 77.47,72.26 81.92,67.82 81.92,65.66 v83.82,63.75 v83.82,30.23 | 36.83,31.5 74.17,31.5 v74.8,30.86
+5V_OTG_PWR  (via drill 0.6)
  Top 0.508: 7.62,14.48 7.62,14.17 USB_OTG.VBUS 7.02,14.26 7.49,14.73
  Top 0.762: RK3188-SOM-EVB_PLATFORM1.4-1 57.15,16.51 57.02,16.64
  Top 1.016: FET1.3 108.84,28.83 108.71,28.96 v73.53,28.96 | 57.02,16.64 55.88,17.78 v54.61,17.78 | v9.14,16 v9.14,14.99 8.64,14.48 7.62,14.48 v9.14,16
  Top 1.27: v9.14,14.99 C54.1 12.19,14.99 L10.1
  Bottom 1.016: 10.29,16.13 18.41,16.13 20.07,17.78 v54.61,17.78 65.79,28.96 v73.53,28.96 | 10.29,16.13 v9.14,14.99 v9.14,16 9.14,16.13 10.29,16.13
+12V  (via drill 0.6, 0.8)
  Top 1.016: 108.84,23.11 109.6,23.11 | 109.6,23.11 U1.2 | 108.84,23.11 v108.84,23.62 109.09,23.62 109.6,23.11 | 108.84,23.11 v108.84,22.35 109.6,23.11 | R7.1 102.23,23.5 v103.12,24.38 | v124.33,15.88 124.33,15.24 v124.33,14.61
  Top 2.54: 126.11,15.24 129.79,15.24 PWR.+ 129.79,19.56 | 126.11,15.24 126.11,12.32 124.21,10.41 C3.+ | 124.33,15.24 126.11,15.24 | 126.11,15.24 D1.C
  Bottom 1.016: v103.12,24.38 107.82,24.38 108.84,23.37
  Bottom 1.524: v124.33,15.88 v124.33,14.61 | 108.84,23.37 v108.84,23.62
  Bottom 2.032: 108.84,23.37 v108.84,22.35 110.11,22.35 | 110.11,22.35 117.86,22.35 v124.33,15.88 v124.33,14.61 | v108.84,23.62 110.11,22.35
  Bottom 2.54: 129.79,19.56 PWR.+ 129.79,16.51
ADC_IN0  (via drill 0.4)
  Top 0.508: RK3188-SOM-EVB_PLATFORM1.3-5 86.36,14.61 v86.61,14.35 | EXT1.3 70.48,4.19 v69.6,4.19
  Bottom 0.254: v69.6,4.19 69.98,4.19 72.77,6.99 82.68,6.99 86.23,10.54 86.23,13.97 v86.61,14.35
ADC_IN2  (via drill 0.4)
  Top 0.254: 70.48,6.99 EXT1.4
  Top 0.508: v86.36,17.27 87,17.27 87.63,16.64 RK3188-SOM-EVB_PLATFORM1.3-7 | v69.47,6.99 70.48,6.99
  Bottom 0.254: v69.47,6.99 69.98,7.49 82.42,7.49 85.72,10.79 85.72,16.51 86.36,17.14 v86.36,17.27
AVDD2  (via drill 0.6)
  Top 0.356: U4.1 18.7,41.69 v18.67,41.66 | U4.5 19.15,39.09 v18.67,38.61 | U4.10 19.41,35.84 18.16,37.08
  Top 1.016: v18.67,41.66 C27.1 17.65,43.31 L4.2 | v18.67,38.61 C26.1 C25.1 18.16,37.08
  Bottom 1.016: v18.67,38.61 v18.67,41.66
CIF_CLKI
  Top 0.254: 44.45,70.61 41.91,73.15 40.26,73.15 39.75,73.66 39.75,79.88 39.62,80.01
  Top 0.508: 44.45,70.61 RK3188-SOM-EVB_PLATFORM1.1-24 | EXT2.20 38.73,80.9 39.62,80.01
CIF_CLKO
  Top 0.254: 45.72,70.61 42.67,73.66 40.51,73.66 40.26,73.91 40.26,79.88 40.39,80.01
  Top 0.508: 45.72,70.61 RK3188-SOM-EVB_PLATFORM1.1-26 | EXT2.22 41.27,80.9 40.39,80.01
CIF_D0  (via drill 0.4)
  Top 0.508: v31.11,78.87 EXT2.13 | RK3188-SOM-EVB_PLATFORM1.1-21 v43.18,66.67
  Bottom 0.254: v43.18,66.67 43.18,70.87 36.45,77.6 34.16,77.6 33.66,78.11 31.88,78.11 v31.11,78.87
CIF_D1  (via drill 0.4)
  Top 0.508: v33.66,78.87 EXT2.15 | RK3188-SOM-EVB_PLATFORM1.1-23 v44.45,66.67
  Bottom 0.254: v44.45,66.67 44.45,70.36 36.7,78.11 34.42,78.11 v33.66,78.87
CIF_D2  (via drill 0.4)
  Top 0.508: v36.2,78.87 EXT2.17 | RK3188-SOM-EVB_PLATFORM1.1-25 v45.72,66.67
  Bottom 0.254: v45.72,66.67 45.72,69.85 36.96,78.61 36.45,78.61 v36.2,78.87
CIF_D3  (via drill 0.4)
  Top 0.508: v38.73,78.87 EXT2.19 | RK3188-SOM-EVB_PLATFORM1.1-27 v46.99,66.67
  Bottom 0.254: v46.99,66.67 46.99,69.34 38.73,77.6 v38.73,78.87
CIF_D4  (via drill 0.4)
  Top 0.508: v41.27,78.87 EXT2.21 | RK3188-SOM-EVB_PLATFORM1.1-29 v48.26,66.67
  Bottom 0.254: v48.26,66.67 48.26,68.71 48.26,68.83 41.27,75.82 v41.27,78.87
CIF_D5  (via drill 0.4)
  Top 0.508: v44.58,73.66 43.81,74.42 EXT2.23 | RK3188-SOM-EVB_PLATFORM1.1-31 v49.53,66.67
  Bottom 0.254: v49.53,66.67 49.53,68.33 44.58,73.28 v44.58,73.66
CIF_D6  (via drill 0.4)
  Top 0.508: v46.35,72.64 EXT2.25 | RK3188-SOM-EVB_PLATFORM1.1-33 v50.8,66.67
  Bottom 0.254: v50.8,66.67 50.8,67.82 46.35,72.26 v46.35,72.64
CIF_D7  (via drill 0.4)
  Top 0.254: v48.9,70.87 48.9,72.9
  Top 0.508: 48.9,72.9 EXT2.27 | RK3188-SOM-EVB_PLATFORM1.1-35 v52.07,66.67
  Bottom 0.254: v52.07,66.67 52.07,67.31 48.9,70.48 v48.9,70.87
CIF_D8  (via drill 0.4)
  Top 0.254: v51.31,70.99 51.44,71.12
  Top 0.508: 51.44,71.12 EXT2.29 | RK3188-SOM-EVB_PLATFORM1.1-37 v53.34,66.67
  Bottom 0.254: v53.34,66.67 53.34,66.8 51.31,68.83 v51.31,70.99
CIF_D9  (via drill 0.4)
  Top 0.254: v52.83,70.99 53.98,72.14 53.98,72.9
  Top 0.508: RK3188-SOM-EVB_PLATFORM1.1-39 v54.61,66.67 | 53.98,72.9 EXT2.31
  Bottom 0.254: v54.61,66.67 54.74,66.8 54.74,67.69 52.83,69.6 v52.83,70.99
CIF_D10/SDA  (via drill 0.4)
  Top 0.254: 54.61,70.61 54.61,70.87 56.52,72.77 56.52,72.9 | U11.13 v93.34,43.33 94.26,43.33 R60.1
  Top 0.508: RK3188-SOM-EVB_PLATFORM1.1-40 54.61,70.61 | 56.52,72.9 56.52,75.95 | 56.52,75.95 EXT2.33 | 56.52,75.95 v57.4,75.95
  Bottom 0.254: v57.4,75.95 57.66,75.69 77.98,75.69 85.72,67.94 85.72,65.79 86.49,65.02 86.49,48.13 89.66,44.96 89.66,43.43 90.04,43.05 93.06,43.05 v93.34,43.33
CIF_D11/SCL  (via drill 0.4)
  Top 0.254: 53.34,70.23 53.34,70.36 55.24,72.26 v55.24,75.44 55.24,79.63 | U11.11 v93.34,42.03 94.24,42.03 R61.1
  Top 0.508: RK3188-SOM-EVB_PLATFORM1.1-38 53.34,70.23 | EXT2.34 56.52,80.9 55.24,79.63
  Bottom 0.254: v55.24,75.44 55.5,75.18 77.72,75.18 85.22,67.69 85.22,65.53 85.98,64.77 85.98,47.88 89.15,44.7 89.15,43.18 89.79,42.55 92.83,42.55 v93.34,42.03
CIF_D12
  Top 0.254: 52.07,70.48 52.07,71.37 52.7,72.01 52.7,79.63
  Top 0.508: RK3188-SOM-EVB_PLATFORM1.1-36 52.07,70.48 | EXT2.32 53.98,80.9 52.7,79.63
CIF_D13
  Top 0.254: 50.55,70.48 50.42,70.61 50.42,79.76 50.55,79.88
  Top 0.508: RK3188-SOM-EVB_PLATFORM1.1-34 50.8,70.23 50.55,70.48 | EXT2.30 51.44,80.77 50.55,79.88
CIF_D14
  Top 0.254: 49.78,70.48 49.91,70.61 49.91,79.76 49.78,79.88
  Top 0.508: RK3188-SOM-EVB_PLATFORM1.1-32 49.53,70.23 49.78,70.48 | EXT2.28 48.9,80.77 49.78,79.88
CIF_D15
  Top 0.254: 48.01,70.48 47.88,70.61 47.88,79.38 47.75,79.5
  Top 0.508: RK3188-SOM-EVB_PLATFORM1.1-30 48.26,70.23 48.01,70.48 | EXT2.26 46.35,80.9 47.75,79.5
CIF_HREF
  Top 0.254: 43.18,70.61 41.15,72.64 40.01,72.64 38.99,73.66 37.97,73.66 37.72,73.91 37.72,79.5
  Top 0.508: 43.18,70.61 RK3188-SOM-EVB_PLATFORM1.1-22 | EXT2.18 36.2,81.03 37.72,79.5
CIF_VSYNC
  Top 0.254: 47.24,70.48 47.37,70.61 47.37,78.87 46.35,79.88 44.83,79.88 44.7,80.01
  Top 0.508: RK3188-SOM-EVB_PLATFORM1.1-28 46.99,70.23 47.24,70.48 | EXT2.24 43.81,80.9 44.7,80.01
DM1  (via drill 0.5)
  Top 0.356: U4.27 26.18,41.04 v25.78,40.64
  Bottom 0.508: 4.08,53.74 4.32,53.98 4.32,56.39 6.22,58.29 11.34,58.29 16.76,52.87 16.76,50.84 25.78,41.82 v25.78,40.64
  Bottom 1.016: USB_HOST1.2 4.08,53.74
DM2  (via drill 0.5)
  Top 0.356: U4.2 21.61,41.04 v21.97,41.4
  Bottom 0.508: 4.08,44.09 4.32,44.32 4.32,46.74 6.22,48.64 14.02,48.64 21.26,41.4 v21.97,41.4
  Bottom 1.016: USB_HOST2.2 4.08,44.09
DM3  (via drill 0.5)
  Top 0.356: U4.8 22.3,37.14 v22.48,36.96
  Bottom 0.508: 4.08,34.44 4.32,34.67 4.32,37.08 6.22,38.99 13.36,38.99 15.39,36.96 v22.48,36.96
  Bottom 1.016: USB_HOST3.2 4.08,34.44
DM4  (via drill 0.5)
  Top 0.356: U4.11 22.09,35.19 v22.61,34.67
  Bottom 0.508: 4.08,24.91 4.32,25.15 4.32,27.43 6.22,29.34 11.56,29.34 16.89,34.67 v22.61,34.67
  Bottom 1.016: USB_HOST4.2 4.08,24.91
DP1  (via drill 0.5)
  Top 0.356: U4.28 25.05,41.69 v24.77,41.4
  Bottom 0.508: v24.77,41.4 24.77,41.91 16.1,50.57 16.1,52.6 11.05,57.66 6.5,57.66 4.95,56.11 4.95,54.84 6.08,53.71
  Bottom 1.016: USB_HOST1.3 6.08,53.71
DP2  (via drill 0.5)
  Top 0.356: U4.3 21.84,40.39 v21.97,40.26
  Bottom 0.508: 6.08,44.05 6.08,44.08 4.95,45.21 4.95,46.46 6.5,48.01 13.74,48.01 21.49,40.26 v21.97,40.26
  Bottom 1.016: 6.08,44.05 USB_HOST2.3
DP3  (via drill 0.5)
  Top 0.356: v22.73,35.81 22.23,35.81 21.55,36.49 U4.9
  Bottom 0.508: 6.08,34.4 4.95,35.53 4.95,36.8 6.5,38.35 13.08,38.35 15.11,36.32 21.84,36.32 22.35,35.81 v22.73,35.81
  Bottom 1.016: 6.08,34.4 USB_HOST3.3
DP4  (via drill 0.5)
  Top 0.356: U4.12 21.34,34.54 22.35,33.53 v22.61,33.53
  Bottom 0.508: v22.61,33.53 22.35,33.53 21.84,34.04 17.17,34.04 11.84,28.7 6.5,28.7 4.95,27.15 4.95,25.88 6.08,24.75
  Bottom 1.016: USB_HOST4.3 6.08,24.75
DVDD1  (via drill 0.6)
  Top 0.356: U4.24 29.24,39.09 v29.46,38.86 | U4.16 28.59,33.89 v29.08,33.4
  Top 1.016: L4.1 15.88,43.56 C28.1 15.88,46.61 | 15.88,46.61 C29.1 | v15.88,48.26 15.88,46.61 | 33.15,33.4 R33.1 | 33.15,33.4 R35.1 | v34.16,33.27 33.27,33.27 33.15,33.4 | v20.95,43.18 25.91,43.18 v26.42,42.67
  Bottom 1.016: v20.95,43.18 v15.88,48.26 | v29.08,33.4 31.11,33.4 | v26.42,42.67 27.05,42.04 27.05,41.27 v29.46,38.86 31.11,37.21 31.11,33.4 | v34.16,33.27 31.24,33.27 31.11,33.4
GND  (via drill 0.4, 0.6, 1)
  Top 0.254: U3.25 111.25,40.03 v111.25,39.24 110.46,39.24 U3.24 | HDMI.2 10.22,62.8 v10.03,62.99 | HDMI.5 10.37,64.3 v10.03,64.64 | HDMI.8 10.4,65.8 v10.03,66.17 | HDMI.11 10.29,67.3 v10.03,67.56 | HDMI.17 10.36,70.3 v10.03,69.98 | U4.15 27.85,33.24 | PWR_LED.C 124.46,1.78 129.29,6.6 C3.-
  Top 0.356: 20.7,33.24 U4.14 19.78,33.24 19.3,32.77 v19.3,32.26 | 20.7,32.89 20.7,33.24 | U4.15 27.05,33.24 27.05,33.15 | 27.05,32.89 27.05,33.15 | 27.85,33.24 28.32,32.77 v28.32,32.13 | 20.7,33.24 21.5,33.24 22.1,32.64 v22.1,32.26 | 27.05,33.15 25.65,33.15 | 25.65,33.15 v25.65,32.38 | 25.65,33.15 v25.65,33.53
  Top 0.381: v13.59,69.6 U5.8 U5.3 | v13.59,66.55 U7.8 U7.3 | v13.59,63.5 U9.8 U9.3
  Top 0.406: U11.20 90.93,47.88 C65.2 | U11.17 90.51,45.93 v90.42,45.85 | U11.14 90.59,43.98 v90.42,43.81 | U11.3 85.98,46.58 | U11.2 85.74,47.23 85.98,46.99 v85.98,46.61 85.98,46.58 | U11.4 85.68,45.93 85.98,46.23 85.98,46.58 | U11.7 85.81,43.98 85.98,43.81 v85.98,43.69 85.98,43.56 85.75,43.33 U11.8
  Top 0.508: 100.84,45.97 RM1.2.2 | R43.1 20.7,46.74 21.59,45.85 U6.2 23.5,45.85 23.88,46.23 23.88,47.5 24.13,47.75 | 7.49,10.54 7.49,10.97 USB_OTG.GND 6.48,10.97 6.48,10.54 | C50.2 45.85,61.98 45.85,63.12 46.48,63.75 49.4,63.75 49.91,63.25 49.91,62.36 C51.2
  Top 0.762: U2.4 108.84,56.01 109.47,56.64 | 23.5,17.4 U10.2 | 23.5,17.4 v23.5,19.05 | 23.5,17.4 23.5,15.88 24,15.37 R54.1 | v61.98,52.07 C43.2 | R41.2 22.23,73.79 v22.23,74.17 | RK3188-SOM-EVB_PLATFORM1.3-4 85.09,20.83 v88.39,24.13 | RK3188-SOM-EVB_PLATFORM1.4-2 57.15,20.32 v55.37,20.32 | v85.09,70.74 RK3188-SOM-EVB_PLATFORM1.LCD-4 | v83.82,71.12 RK3188-SOM-EVB_PLATFORM1.LCD-2 | v55.75,69.34 RK3188-SOM-EVB_PLATFORM1.2-2 | RK3188-SOM-EVB_PLATFORM1.1-2 v30.48,70.74 | C41.2 35.43,53.09 v34.29,54.23 | v34.29,49.78 C42.2 | v34.29,58.93 R42.2
  Top 1.016: C6.2 C5.2 C2.2 C1.2 v120.27,23.75 | v99.31,27.69 R1.2 R2.2 | v99.31,27.69 v99.31,26.67 v99.31,27.69 | v100.97,24.64 100.97,22.1 101.35,21.72 C4.2 | C18.1 C19.1 C17.1 | v113.79,34.92 C17.1 | v116.46,46.74 R15.1 | C17.1 C16.1 C10.1 | v119.38,34.42 C9.1 | v108.33,48.01 C14.1 C13.1 104.52,48.01 103.89,48.64 101.47,48.64 100.84,48.01 RM1.4.2 RM1.3.2 100.84,45.97 | v111.89,44.45 112.01,44.45 112.65,45.09 C15.1 | v102.23,37.59 102.11,37.72 C20.1 | 110.11,61.47 C12.2 | 109.47,56.64 110.11,57.28 v110.11,57.91 110.11,61.47 | 110.11,61.47 C11.1 110.87,62.1 111.76,62.99 v115.19,62.99 | L8.1 12.57,55.63 11.81,55.63 v11.18,54.99 C59.1 11.18,53.21 | USB_HOST1.4 8.1,53.21 11.18,53.21 | USB_HOST2.4 8.1,43.56 11.18,43.56 | USB_HOST4.4 8.1,24.26 11.18,24.26 | USB_HOST3.4 8.1,33.91 11.18,33.91 | 12.19,17.91 C22.2 | C29.2 C28.2 | R43.1 C29.2 | v14.48,41.66 C27.2 R31.1 C26.2 C25.2 R32.2 C32.1 v14.48,34.04 14.48,31.5 14.86,31.11 v14.86,30.23 | v14.48,51.18 14.86,51.18 17.65,48.39 C29.2 | v20.7,32.26 20.7,32.89 | v27.05,32.13 27.05,32.89 | 28.96,46.23 C37.2 v28.96,48.64 27.81,49.78 26.16,49.78 24.13,47.75 | 28.96,46.23 R44.1 | 23.88,25.15 C21.1 | 23.88,25.15 C24.1 | 12.19,17.91 13.08,17.02 C55.2 C63.2 v17.78,18.03 | 23.88,23.62 23.88,25.15 | R53.1 C56.2 v23.5,19.05 | R55.1 C57.2 C58.2 v28.45,19.43 | C54.2 v10.41,17.91 v11.43,17.91 12.19,17.91 | v7.49,10.03 7.49,10.54 | 6.48,10.54 v6.48,10.03 v7.49,10.03 | v7.49,10.03 8.13,10.67 8.89,10.67 L9.1 | C40.2 C53.2 C52.2 R42.2 | 51.94,62.1 C45.2 | C51.2 C46.2 51.94,62.1 | v61.98,55.88 C48.2 C49.2 | v34.29,36.83 R29.1 C33.2 C35.2 v33.15,40.89 | 51.94,62.1 v51.94,63.12 | 109.47,25.65 U1.4 v112.78,25.65
  Top 1.016: UEXT1.2 22.23,10.41 v21.08,10.41 | UEXT2.2 v45.09,11.56 | EXT1.2 67.94,10.41 v69.09,10.41 | v88.39,24.13 91.95,27.69 v99.31,27.69 | EXT2.40 64.14,84.2 v65.28,84.2 | LCD.2 74.3,84.2 v73.15,84.2 | v75.69,84.2 76.83,84.2 LCD.4 v76.83,79.76 | 3.0V_BAT.- 125.72,45.21 v124.71,45.21 C214.2 R14.2 | R54.1 v25.02,14.99 | CD1.2 v109.98,53.85 | 28.96,46.23 30.48,46.23 32.26,44.45 v33.15,44.45 38.23,44.45 39.88,42.8 R40.2 R38.2 C47.2 C44.2 46.74,42.8 v48.26,41.27 | v12.19,27.69 C31.2 | 11.18,24.26 C62.1 | v11.18,26.04 C23.1 11.18,24.26 | v11.18,35.69 C30.1 11.18,33.91 | 11.18,33.91 C61.1 | v12.19,37.34 C36.2 | v11.18,45.34 C34.1 11.18,43.56 | C60.1 11.18,43.56 | 11.18,53.21 C38.1 | v12.19,46.99 C39.2 | C65.2 C64.2 v90.17,51.18 | C66.1 C67.1 v96.14,47.5 | 11.56,82.5 EXT2.2
  Top 1.524: 20.57,23.62 23.88,23.62
  Top 1.778: 133.09,22.48 PWR.-- | 136.29,21.84 136.29,22.2 136.02,22.48 133.09,22.48 | 133.09,22.48 132.21,22.48
  Top 2.032: 3.0V_BAT.- 128.14,57.53 v122.68,62.99
  Top 2.54: C3.- 136.29,16.02 PWR.- 136.29,21.84 | v126.11,21.72 D1.A
  Bottom 0.254: 40.64,68.71 41.15,69.22 41.15,71.37 39.88,72.64 37.08,72.64
  Bottom 1.016: 118.36,25.65 118.11,25.91 118.11,33.15 v119.38,34.42 118.87,34.92 v113.79,34.92 111.89,36.83 111.89,38.61 v111.25,39.24 | v111.25,39.24 108.33,39.24 106.43,37.34 102.49,37.34 v102.23,37.59 | v116.46,46.74 115.19,48.01 v111.25,48.01 v108.33,48.01 108.08,47.75 108.08,43.02 U3.EP6 | v122.68,62.99 v115.19,62.99 | 111.25,41.28 U3.EP9 | v111.25,39.24 111.25,41.28 | 111.25,41.28 111.25,43.81 v111.89,44.45 | v14.86,30.23 15.88,30.23 17.91,32.26 v20.7,32.26 v22.1,32.26 26.92,32.26 v27.05,32.13 27.94,31.24 33.91,31.24 35.43,32.77 35.43,35.69 v34.29,36.83 | v7.49,10.03 6.99,10.03 v6.48,10.03 | 21.46,21.08 v23.5,19.05 28.07,19.05 v28.45,19.43 | 10.03,69.6 v13.59,69.6 | 10.03,66.55 v13.59,66.55 | 10.03,63.5 v13.59,63.5 | U8.GND4 48.26,49 v48.26,41.27 52.32,37.21 60.83,37.21 61.98,38.35 v61.98,40.51 v61.98,52.07 v61.98,55.88 | 100.97,25.91 v100.97,24.64 | v69.09,10.41 v64.9,10.41 | v65.28,84.2 v73.15,84.2 v75.69,84.2 | v85.09,70.74 84.2,70.74 v83.82,71.12 77.22,77.72 77.22,79.38 v76.83,79.76 | v51.94,63.12 53.72,64.9 54.48,64.9 55.75,66.17 v55.75,69.34 59.69,73.28 v63.75,73.28 | v33.15,40.89 v33.15,44.45 | v34.29,58.93 v34.29,54.23 v34.29,49.78 33.15,48.64 v28.96,48.64
  Bottom 1.27: v10.03,64.64 v10.03,66.17 | 10.03,66.55 v10.03,67.56 10.03,69.6 | v10.03,69.98 10.03,74.11 | 4.06,74.1 HDMI.SH3 7.11,74.1 | 4.06,59.5 HDMI.SH2 10.03,59.5 | 10.03,59.5 v10.03,62.99 | 10.03,59.5 HDMI.SH1 11.43,59.5
  Bottom 1.524: v126.11,21.72 v124.33,21.72 122.3,21.72 v120.27,23.75 118.36,25.65 v112.78,25.65 v109.35,25.65 109.09,25.91 100.97,25.91 100.08,25.91 v99.31,26.67 v99.31,27.69 | v11.43,17.91 v10.41,17.91 8.38,17.91 6.99,16.51 6.99,10.03 6.99,8.26 | 11.43,74.1 HDMI.SH4 8.89,74.1 | v10.03,62.99 10.03,63.5 v10.03,64.64 | v10.03,66.17 10.03,66.55 | 10.03,69.6 v10.03,69.98 | 10.03,74.11 8.89,74.11 8.89,74.1 | 8.89,74.1 7.11,74.1
  Bottom 2.54: 136.27,16.51 136.27,22.48 132.21,22.48
  other vias: 19.3,31.24 20.7,31.24 22.1,31.24 25.65,31.24 25.65,34.67 60.33,77.09 61.59,79.5 39.37,29.21 44.45,29.21 41.91,26.67 46.99,26.67 39.37,24.13 44.45,24.13 49.53,24.13 50.8,29.21 55.88,29.21 60.96,29.21 81.28,35.56 81.28,40.64 81.28,45.72 78.74,43.18 78.74,33.02 76.2,35.56 74.93,45.72 77.47,48.26 81.28,55.88 74.93,48.26 77.47,50.8 86.36,33.02 86.36,38.1 88.9,35.56 91.44,38.1 78.74,38.1 76.2,40.64 87.63,55.88 92.71,55.88 90.17,58.42 95.25,58.42 92.71,60.96 87.63,60.96 90.17,62.23 95.25,62.23 100.33,62.23 105.41,62.23 77.47,55.88 81.28,59.69 80.01,50.8 36.83,26.67 36.83,21.59 34.29,24.13 41.91,15.24 41.91,10.16 36.83,10.16 39.37,12.7 36.83,15.24 39.37,7.62 34.29,12.7 87,27.3 83.19,27.3 79.38,27.3 68.58,35.56 68.58,40.89 63.5,40.89 66.04,43.43 115.44,66.67 134.62,44.45 137.16,46.99 132.08,46.99 134.62,49.53 137.16,52.07 132.08,52.07 134.62,54.61 137.16,57.15 132.08,57.15 134.62,59.69 137.16,62.23 132.08,62.23 134.62,64.77 137.16,67.31 132.08,67.31 134.62,69.85 129.54,64.77 129.54,59.69 129.54,54.61 129.54,49.53 127,46.99 127,52.07 127,57.15 127,62.23 127,67.31 121.92,67.31 110.36,66.67 112.9,69.22 117.98,69.22 120.52,71.75 134.62,74.93 137.16,72.39 124.46,64.77 121.92,62.23 124.46,59.69 119.38,59.69 121.92,57.15 119.38,54.61 124.46,54.61 121.92,52.07 124.46,49.53 121.92,46.99 119.38,64.77 112.9,64.14 115.44,71.75 64.01,24.89 25.65,35.81 25.65,36.96 25.65,38.1 25.65,39.24 24.51,39.24 23.75,40.13 66.04,38.35 57.15,5.08 59.69,7.62 62.23,5.08 64.77,7.62 62.23,10.16 41.91,20.32 37.08,0.89 40.39,0.89 59.94,0.89 63.25,0.89 39.37,34.29 31.75,21.46 31.75,15.88 31.75,29.21 29.21,26.67 14.99,27.05 13.72,19.43 20.32,20.32 17.78,22.86 20.32,15.11 17.78,20.32 15.24,60.96 17.78,58.42 19.68,56.52 23.5,52.7 25.4,50.8 28.45,50.93 100.58,32.13 110.49,15.24 110.49,12.7 113.03,12.7 118.11,13.97 120.65,13.97 120.65,11.43 68.96,74.3 88.9,40.64 92.71,50.8
  pour Top (isolate 0.305, rank 2): 140.97,-2.54 -2.54,-2.54 -2.54,87.63 140.97,87.63 140.97,40.64 132.21,40.64 131.83,41.02 125.86,41.02 125.48,41.4 125.48,43.05 125.09,43.43 121.92,43.43 121.16,42.67 121.16,23.24 127.64,23.24 128.14,22.73 130.68,22.73 131.06,23.11 140.84,23.11
  pour Bottom (isolate 0.305, rank 3): -5.08,-5.08 143.51,-5.08 143.51,23.88 131.83,23.88 130.68,22.73 128.14,22.73 127,23.88 121.54,23.88 121.54,43.05 121.92,43.43 125.09,43.43 125.48,43.05 125.48,41.4 125.86,41.02 131.06,41.02 132.21,39.88 143.51,39.88 143.51,90.17 -5.08,90.17
  pour Bottom (isolate 0.406, no thermals): 106.68,44.32 110.87,44.32 110.87,40.01 106.68,40.01
  pour Bottom (isolate 0.406, no thermals): 44.07,56.39 52.96,56.39 52.96,47.5 44.07,47.5
  pour Top (isolate 0.406, no thermals): 44.7,55.88 52.32,55.88 52.32,48.13 44.7,48.13
GPIO0_A1  (via drill 0.4)
  Top 0.508: EXT2.5 v20.95,78.87 | v35.94,66.67 35.56,66.29 RK3188-SOM-EVB_PLATFORM1.1-9
  Bottom 0.254: v35.94,66.67 35.94,67.94 26.29,77.6 25.4,77.6 24.89,78.11 21.72,78.11 v20.95,78.87
GPIO0_A2/ETH_SOFT_RST  (via drill 0.4)
  Top 0.254: v74.68,32.64 76.2,31.11 105.16,31.11 108.2,34.16 R17.1 | v40.89,41.02 41.15,41.27 43.05,41.27 43.94,40.39 44.83,40.39 45.85,39.37 58.93,39.37 59.18,39.12 60.71,39.12 61.09,38.73 61.09,37.97 66.42,32.64 v67.31,32.64
  Top 0.508: v36.96,63.88 36.83,64.01 RK3188-SOM-EVB_PLATFORM1.1-11
  Bottom 0.254: v67.31,32.64 v74.68,32.64 | v36.96,63.88 36.96,64.26 35.81,65.41 35.31,65.41 34.67,66.04 34.67,67.69 34.29,68.07 33.53,68.07 33.15,67.69 33.15,66.93 33.66,66.42 33.66,61.85 35.69,59.82 35.69,47.12 40.89,41.91 v40.89,41.02
GPIO0_A3/USB-HOST-DRV  (via drill 0.4)
  Top 0.254: 27.18,45.09 v29.97,45.09
  Top 0.508: U6.4 26.61,44.9 26.67,44.96 | v37.97,63.88 38.1,64.01 RK3188-SOM-EVB_PLATFORM1.1-13
  Top 1.016: 27.18,44.96 R51.2 | 27.18,44.96 27.18,45.09 R44.2 | 26.67,44.96 27.18,44.96
  Bottom 0.254: v37.97,63.88 37.97,64.01 36.07,65.91 35.56,65.91 35.18,66.29 35.18,67.94 34.54,68.58 33.27,68.58 32.64,67.94 32.64,66.67 33.15,66.17 33.15,61.59 35.18,59.56 35.18,49.4 30.86,45.09 v29.97,45.09
GPIO0_A5  (via drill 0.4)
  Top 0.254: v36.96,66.93 37.34,66.55 39.24,66.55 39.37,66.42
  Top 0.508: EXT2.7 v23.5,78.87 | 39.37,66.42 RK3188-SOM-EVB_PLATFORM1.1-15
  Bottom 0.254: v36.96,66.93 36.96,67.69 26.54,78.11 25.65,78.11 25.15,78.61 23.75,78.61 v23.5,78.87
GPIO0_A6  (via drill 0.4)
  Top 0.254: v37.97,67.31 38.23,67.06 40.01,67.06 40.64,66.42
  Top 0.508: EXT2.9 v26.04,78.87 | 40.64,66.42 RK3188-SOM-EVB_PLATFORM1.1-17
  Bottom 0.254: v37.97,67.31 37.97,67.44 26.8,78.61 26.29,78.61 v26.04,78.87
GPIO0_A7  (via drill 0.4)
  Top 0.508: v28.57,78.87 EXT2.11 | RK3188-SOM-EVB_PLATFORM1.1-19 v41.91,66.67
  Bottom 0.254: v41.91,66.67 41.91,71.37 36.2,77.09 33.91,77.09 33.4,77.6 31.24,77.6 29.97,78.87 v28.57,78.87
GPIO0_B0
  Top 0.254: 34.29,70.61 32.26,72.64 29.84,72.64 29.34,73.15 27.56,73.15 27.05,73.66 25.27,73.66 24.77,74.17 24.77,78.74 23.88,79.63 22.48,79.63 22.35,79.76
  Top 0.508: 34.29,70.61 RK3188-SOM-EVB_PLATFORM1.1-8 | EXT2.6 20.95,81.15 22.35,79.76
GPIO0_B1
  Top 0.254: 24.77,79.76 24.89,79.63 26.42,79.63 27.3,78.74 27.3,74.17 27.81,73.66 29.59,73.66 30.1,73.15 33.02,73.15 35.56,70.61
  Top 0.508: EXT2.8 23.5,81.03 24.77,79.76 | 35.56,70.61 RK3188-SOM-EVB_PLATFORM1.1-10
GPIO0_B2
  Top 0.254: 36.83,70.61 33.78,73.66 30.35,73.66 29.84,74.17 29.84,78.74 28.96,79.63 27.43,79.63 27.3,79.76
  Top 0.508: 36.83,70.61 RK3188-SOM-EVB_PLATFORM1.1-12 | EXT2.10 26.04,81.03 27.3,79.76
GPIO0_B4/LED1  (via drill 0.4)
  Top 0.254: v43.81,37.97 44.2,37.97 44.83,37.34 57.91,37.34 67.06,28.19 67.06,26.67 66.42,26.04 v66.42,25.27
  Top 0.508: EXT1.18 88.27,10.92 v88.01,11.18 | v37.72,70.74 38.1,70.36 RK3188-SOM-EVB_PLATFORM1.1-14
  Bottom 0.254: v88.01,11.18 87.38,11.81 87.38,15.88 87.12,16.13 87.12,17.65 86.61,18.16 85.47,18.16 81.53,22.1 74.55,22.1 73.03,23.62 67.31,23.62 66.42,24.51 v66.42,25.27 | v37.72,70.74 39.24,69.22 39.24,59.69 37.72,58.17 37.72,48.13 43.81,42.04 v43.81,37.97
GPIO0_B6/LED2  (via drill 0.4)
  Top 0.254: v42.93,38.73 44.2,38.73 45.09,37.85 58.17,37.85 67.56,28.45 67.56,26.04 v67.31,25.78
  Top 0.508: v90.3,11.43 90.81,10.92 EXT1.20 | v39.75,70.87 40.01,70.87 40.64,70.23 RK3188-SOM-EVB_PLATFORM1.1-18
  Bottom 0.254: v90.3,11.43 89.92,11.81 89.92,14.1 87.63,16.38 87.63,17.91 86.87,18.67 85.72,18.67 81.79,22.61 74.8,22.61 73.28,24.13 67.56,24.13 67.18,24.51 67.18,25.65 v67.31,25.78 | v39.75,70.87 38.73,70.87 38.1,71.5 37.34,71.5 36.96,71.12 36.96,70.36 38.73,68.58 38.73,59.94 37.21,58.42 37.21,47.88 43.31,41.78 43.31,39.12 v42.93,38.73
GPIO0_B7
  Top 0.254: 41.91,70.61 40.39,72.14 39.75,72.14 38.73,73.15 37.72,73.15 37.21,73.66 37.21,78.99 36.58,79.63 29.97,79.63 29.84,79.76
  Top 0.508: 41.91,70.61 RK3188-SOM-EVB_PLATFORM1.1-20 | EXT2.12 28.57,81.03 29.84,79.76
GPIO0_C0  (via drill 0.4)
  Top 0.508: EXT1.26 98.42,10.16 v97.54,10.16 | v88.39,18.29 87.63,19.05 RK3188-SOM-EVB_PLATFORM1.3-8
  Bottom 0.254: v97.54,10.16 97.28,9.91 92.96,9.91 90.42,12.45 90.42,14.35 88.14,16.64 88.14,18.03 v88.39,18.29
GPIO0_C1  (via drill 0.4)
  Top 0.254: v88.9,17.4 89.15,17.65 89.15,18.8
  Top 0.508: EXT1.28 100.97,10.29 v100.08,11.18 | 89.15,18.8 88.9,19.05 RK3188-SOM-EVB_PLATFORM1.3-10
  Bottom 0.254: v100.08,11.18 99.82,10.92 95.89,10.92 95.38,10.41 93.22,10.41 90.93,12.7 90.93,14.61 88.9,16.64 v88.9,17.4
GPIO0_C2  (via drill 0.4)
  Top 0.254: v90.93,17.4 90.17,18.16
  Top 0.508: v103.5,11.43 EXT1.30 | 90.17,18.16 RK3188-SOM-EVB_PLATFORM1.3-12
  Bottom 0.254: v90.93,17.4 90.93,16.89 93.85,13.97 102.36,13.97 103.5,12.83 v103.5,11.43
GPIO0_C3  (via drill 0.4)
  Top 0.508: v91.19,18.41 91.44,18.67 RK3188-SOM-EVB_PLATFORM1.3-14 | v105.03,10.67 106.05,10.67 EXT1.32
  Bottom 0.254: v91.19,18.41 91.69,17.91 91.69,16.89 94.11,14.48 102.62,14.48 105.03,12.06 v105.03,10.67
GPIO0_C4  (via drill 0.4)
  Top 0.508: v92.33,18.41 92.71,18.8 RK3188-SOM-EVB_PLATFORM1.3-16 | v107.57,9.91 108.58,9.91 EXT1.34
  Bottom 0.254: v92.33,18.41 92.2,18.29 92.2,17.14 94.36,14.99 102.87,14.99 107.57,10.29 v107.57,9.91
GPIO0_C5  (via drill 0.4)
  Top 0.508: v93.85,18.41 93.98,18.54 RK3188-SOM-EVB_PLATFORM1.3-18 | v110.11,8.13 111.12,8.13 EXT1.36
  Bottom 0.254: v93.85,18.41 93.73,18.29 93.73,16.38 94.61,15.49 103.12,15.49 110.11,8.51 v110.11,8.13
GPIO0_C6  (via drill 0.4)
  Top 0.508: v95.38,18.41 95.25,18.54 RK3188-SOM-EVB_PLATFORM1.3-20 | v112.65,7.11 113.67,7.11 EXT1.38
  Bottom 0.254: v95.38,18.41 95.25,18.29 95.25,17.02 96.27,16 103.38,16 112.27,7.11 v112.65,7.11
GPIO0_C7  (via drill 0.4)
  Top 0.254: v96.01,17.4 96.52,17.91 96.52,18.41
  Top 0.508: 96.52,18.41 RK3188-SOM-EVB_PLATFORM1.3-22 | v115.19,7.87 116.2,7.87 EXT1.40
  Bottom 0.254: v96.01,17.4 96.9,16.51 103.63,16.51 112.27,7.87 v115.19,7.87
GPIO0_D0/FLASH_DQS
  Top 0.254: 72.64,14.67 72.64,14.48 73.66,13.46 74.8,13.46 75.31,12.95 84.58,12.95 85.6,11.94 86.74,11.94 87.25,11.43 87.25,6.6 87.63,6.22 89.41,6.22 89.92,5.71 91.69,5.71 92.2,5.21 94.87,5.21 95,5.08
  Top 0.508: 72.64,14.67 72.39,14.92 RK3188-SOM-EVB_PLATFORM1.4-25 | EXT1.23 95.89,4.19 95,5.08
GPIO0_D1/FLASH_CSN1  (via drill 0.4)
  Top 0.254: 73.66,14.61 74.3,13.97 75.06,13.97 75.56,13.46 84.84,13.46 85.85,12.45 87,12.45 87.5,11.94 88.52,11.94 89.53,10.92 v89.53,8.13
  Top 0.508: 73.66,14.61 RK3188-SOM-EVB_PLATFORM1.4-27 | v97.54,4.95 97.66,4.95 98.42,4.19 EXT1.25
  Bottom 0.254: v89.53,8.13 92.71,4.95 v97.54,4.95
GPIO0_D2/FLASH_CSN2
  Top 0.254: 74.93,14.61 75.06,14.48 75.31,14.48 75.82,13.97 85.09,13.97 86.11,12.95 87.25,12.95 87.76,12.45 88.77,12.45 89.03,12.19 90.81,12.19 91.82,11.18 91.82,6.35 92.46,5.71 99.06,5.71 99.95,4.83
  Top 0.508: 74.93,14.61 RK3188-SOM-EVB_PLATFORM1.4-29 | 99.95,4.83 100.97,4.83 EXT1.27
GPIO0_D3/FLASH_CSN3
  Top 0.254: 76.2,14.61 76.33,14.48 85.34,14.48 86.36,13.46 87.5,13.46 88.01,12.95 89.03,12.95 89.28,12.7 91.06,12.7 92.33,11.43 92.33,6.6 92.71,6.22 99.31,6.22 100.08,5.46 102.23,5.46 102.36,5.33
  Top 0.508: 76.2,14.61 RK3188-SOM-EVB_PLATFORM1.4-31 | EXT1.29 103.5,4.19 102.36,5.33
GPIO0_D4/SPI1_MISO  (via drill 0.4)
  Top 0.508: v77.47,17.14 RK3188-SOM-EVB_PLATFORM1.4-33 | UEXT2.7 v52.7,5.21
  Bottom 0.254: v77.47,17.14 77.22,16.89 75.56,16.89 72.9,19.56 65.41,19.56 59.69,13.84 58.04,13.84 52.7,8.51 v52.7,5.21
GPIO0_D5/SPI1_MOSI  (via drill 0.4)
  Top 0.254: UEXT2.8 52.7,8.38
  Top 0.508: v78.74,17.14 RK3188-SOM-EVB_PLATFORM1.4-35 | 52.7,8.38 v53.72,8.38
  Bottom 0.254: v78.74,17.14 77.98,16.38 75.31,16.38 72.64,19.05 65.66,19.05 59.94,13.34 58.29,13.34 53.72,8.76 v53.72,8.38
GPIO0_D6/SPI1_CLK  (via drill 0.4)
  Top 0.508: v80.01,17.14 RK3188-SOM-EVB_PLATFORM1.4-37 | UEXT2.9 v55.24,5.21
  Bottom 0.254: v80.01,17.14 78.74,15.88 75.06,15.88 72.39,18.54 65.91,18.54 60.2,12.83 58.55,12.83 55.24,9.53 v55.24,5.21
GPIO0_D7/SPI1_CSNO  (via drill 0.4)
  Top 0.254: UEXT2.10 55.24,9.4 55.24,10.41 52.58,13.08 52.07,13.08 R58.1
  Top 0.508: v81.28,17.14 RK3188-SOM-EVB_PLATFORM1.4-39 | 55.24,9.4 v56.26,9.4
  Bottom 0.254: v81.28,17.14 79.5,15.37 74.8,15.37 72.14,18.03 66.17,18.03 60.45,12.32 58.8,12.32 56.26,9.78 v56.26,9.4
GPIO1_A0/UART0_RX  (via drill 0.4)